# Altium project amplifier sp.PrjPCB
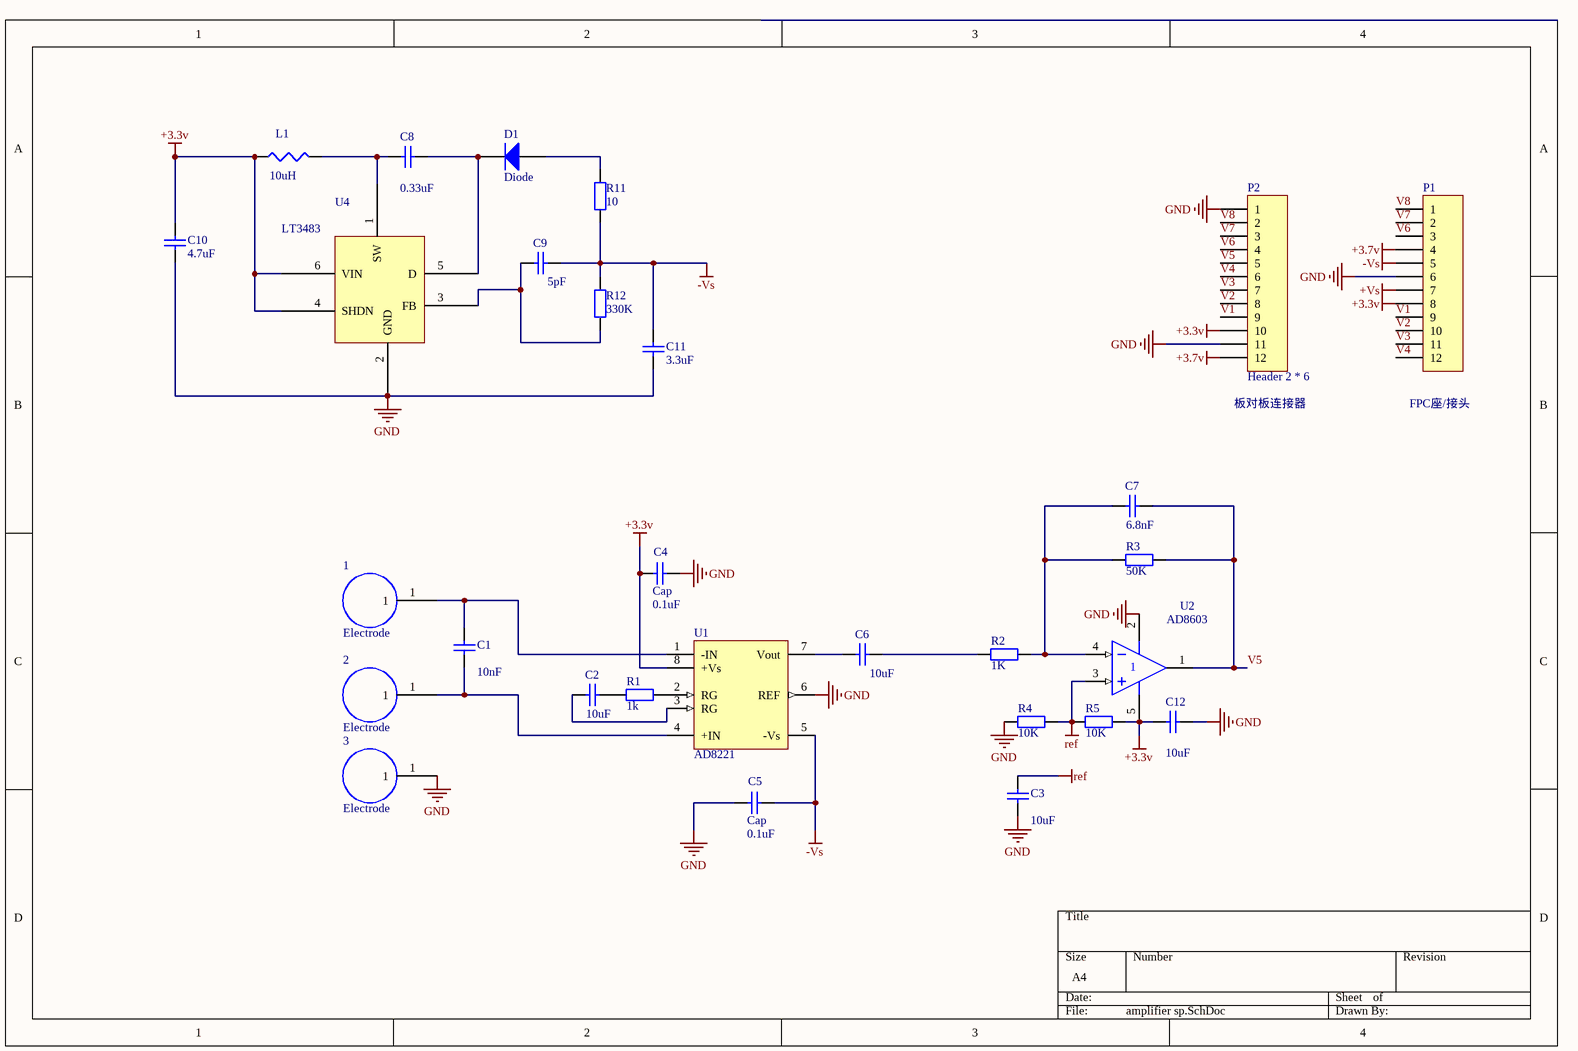
[diagram p0: amplifier sp.SchDoc]
1 sheet, 29 parts. Net scope: global (net labels, ports and power ports of the same name join across sheets).
Board file: amplifier sp.PcbDoc

## Sheet amplifier sp.SchDoc
size A4

### Parts
1  Electrode  [elec-diff]
2  Electrode  [elec-diff]
3  Electrode  [elec-ref]
C1  value 10nF  [1608[0603]]
C2  value 10uF  [1608[0603]]
C3  value 10uF  [1608[0603]]
C4  Cap  value 0.1uF  [1608[0603]]
C5  Cap  value 0.1uF  [1608[0603]]
C6  value 10uF  [1608[0603]]
C7  value 6.8nF  [1608[0603]]
C8  value 0.33uF  [1608[0603]]  (hidden comment: Cap Semi)
C9  value 5pF  [1608[0603]]  (hidden comment: Cap Semi)
C10  value 4.7uF  [1608[0603]]  (hidden comment: Cap Semi)
C11  value 3.3uF  [1608[0603]]  (hidden comment: Cap Semi)
C12  value 10uF  [1608[0603]]
D1  Diode  [D0402]
L1  value 10uH  [1608[0603]]  (hidden comment: Res3)
P1  (no value)  [12P_0.5mm()FPC]
P2  Header 2 * 6  [btb0.5*12top]
R1  1k  [1608[0603]]
R2  1K  [1608[0603]]
R3  50K  [1608[0603]]
R4  10K  [1608[0603]]
R5  10K  [1608[0603]]
R11  10  [1608[0603]]
R12  330K  [1608[0603]]
U1  AD8221  [MSOP-8]
U2  AD8603  [SOT23-5AM]
U4  LT3483  [LT3843]

### Nets
+3.3v: C4.1 C10.2 C12.2 L1.1 P1.8 P2.10 R5.2 U1.8(+Vs) U2.5(V-) U4.4(SHDN) U4.6(VIN)
+3.7v: P1.4 P2.12
+Vs: P1.7
-Vs: C5.2 C9.2 C11.1 P1.5 R11.2 R12.1 U1.5(-Vs)
GND: 3.1 C3.1 C4.2 C5.1 C10.1 C11.2 C12.1 P1.6 P2.1 P2.11 R4.1 U1.6(REF) U2.2(V+) U4.2(GND)
ref: C3.2 R4.2 R5.1 U2.3(IN+)
V1: P1.9 P2.9
V2: P1.10 P2.8
V3: P1.11 P2.7
V4: P1.12 P2.6
V5: C7.1 P2.5 R3.2 U2.1(OUT)
V6: P1.3 P2.4
V7: P1.2 P2.3
V8: P1.1 P2.2
Net1_1: 1.1 C1.2 U1.1(-IN)
Net2_1: 2.1 C1.1 U1.4(+IN)
NetC2_1: C2.1 R1.2
NetC2_2: C2.2 U1.3(RG)
NetC6_1: C6.1 R2.1
NetC6_2: C6.2 U1.7(Vout)
NetC7_2: C7.2 R2.2 R3.1 U2.4(IN-)
NetC8_1: C8.1 L1.2 U4.1(SW)
NetC8_2: C8.2 D1.2(K) U4.5(D)
NetC9_1: C9.1 R12.2 U4.3(FB)
NetD1_1: D1.1(A) R11.1
NetR1_1: R1.1 U1.2(RG)

### Notes on the sheet
- (near P2) 板对板连接器
- (near P1) FPC座/接头

### Library data of the parts
C1-C7 C12 = Cap: Capacitor; Published: 8-Jun-2000; LatestRevisionDate: 17-Jul-2002; LatestRevisionNote: Re-released for DXP Platform.; PackageReference: RAD-0.3; Publisher: Altium Limited
C8-C11 = Cap Semi: Capacitor (Semiconductor SIM Model); Published: 8-Jun-2000; LatestRevisionDate: 29-May-2009; LatestRevisionNote: IPC-7351 Footprint Added.; PackageReference: C1206; Publisher: Altium Limited; PackageDescription: Chip Capacitor
D1 = Diode: Default Diode; Published: 8-Jun-2000; LatestRevisionDate: 17-Jul-2002; LatestRevisionNote: Re-released for DXP Platform.; PackageVersion: Sep-1996; PackageReference: SMC; Publisher: Altium Limited; PackageDescription: DO-214-AB/SMC; 2 C-Bend Leads; Body 7.9 x 5.9 mm, inc. leads (LxW); Code_JEDEC: DO-214-AB
L1 = Res3: Resistor; Published: 8-Jun-2000; LatestRevisionDate: 29-May-2009; LatestRevisionNote: IPC-7351 Footprint Added.; PackageReference: 1608; Publisher: Altium Limited; PackageDescription: Chip Resistor
P1 P2 = Header 12: Header, 12-Pin; LatestRevisionDate: 17-Jul-2002; LatestRevisionNote: Re-released for DXP Platform.; Publisher: Altium Limited
R1-R5 R11 R12 = Res2: Resistor; Published: 8-Jun-2000; LatestRevisionDate: 17-Jul-2002; LatestRevisionNote: Re-released for DXP Platform.; PackageReference: AXIAL-0.4; Publisher: Altium Limited
U1 = INA128UA: Precision, Low-Power Instrumentation Amplifiers; Published: 8-Jun-2000; LatestRevisionDate: 13-Apr-2006; LatestRevisionNote: IPC-7351 Footprint Added.; DatasheetVersion: Oct-1996; PackageReference: 182H; Publisher: Altium Limited; PackageDescription: 8-Pin Small Outline Integrated Circuit 1.27 mm Pitch; Code_JEDEC: MS-012-AA; Code_IPC: SOIC127P600-8; ComponentLink1Description: Manufacturer Link; ComponentLink1URL: http://www.ti.com/; ComponentLink2Description: Datasheet; ComponentLink2URL: http://www-s.ti.com/sc/ds/INA128.pdf